# Altium schematic sheet Sheet4.SchDoc
size A
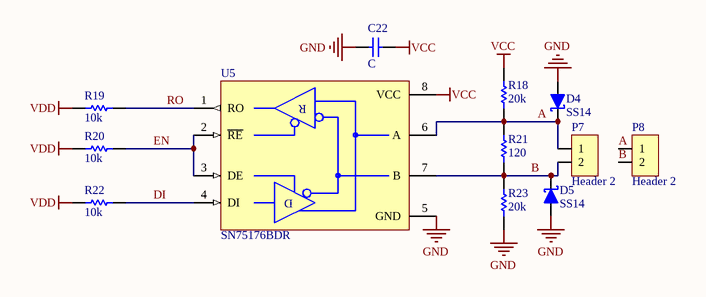
[diagram p0: Sheet4.SchDoc]

## Parts
C22  C  [C 0805 (2012)]
D4  SS14  [DO-214AC (SMA)]
D5  SS14  [DO-214AC (SMA)]
P7  Header 2  [HDR Domino 2]
P8  Header 2  [HDR Domino 2]
R18  20k  [R 0805 (2012)]
R19  10k  [R 0805 (2012)]
R20  10k  [R 0805 (2012)]
R21  120  [R 0805 (2012)]
R22  10k  [R 0805 (2012)]
R23  20k  [R 0805 (2012)]
U5  SN75176BDR  [SOIC-8]

## Nets
GND: C22.2 D4.1(A) D5.1(A) R23.1 U5.5(GND)
VCC: C22.1 R18.2 U5.8(VCC)
VDD: R19.2 R20.2 R22.2
A: D4.2(K) P7.1 P8.1 R18.1 R21.2 U5.6(A)
B: D5.2(K) P7.2 P8.2 R21.1 R23.2 U5.7(B)
DI: R22.1 U5.4(DI)
EN: R20.1 U5.2(~{RE}) U5.3(DE)
RO: R19.1 U5.1(RO)

## Notes on the sheet
- (in symbol MAX485) R; D

## Library data of the parts
C22 = Capacitor NP: Capacitor non-pol
D4 D5 = Diode Schottky: Schottky Diode; Published: 8-Jun-2000; LatestRevisionDate: 17-Jul-2002; LatestRevisionNote: Re-released for DXP Platform.; PackageReference: SMB; Publisher: Altium Limited; Code_JEDEC: DO-214-AA
P7 P8 = Header 2: Header, 2-Pin; LatestRevisionDate: 17-Jul-2002; LatestRevisionNote: Re-released for DXP Platform.; Publisher: Altium Limited
R18-R23 = Resistor: Published: 8-Jun-2000; LatestRevisionDate: 17-Jul-2002; LatestRevisionNote: Re-released for DXP Platform.; PackageReference: AXIAL-0.3; Publisher: Altium Limited
U5 = MAX485